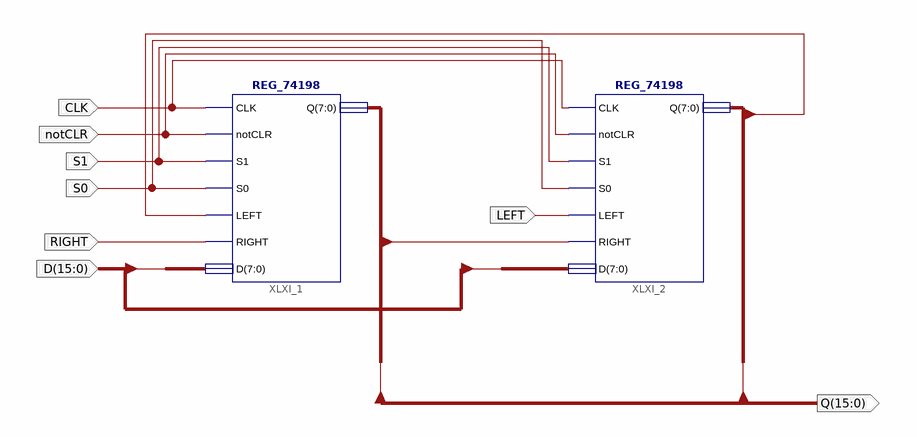
[diagram p0: schematic sheet 1]
// Xilinx ISE schematic REG_UNIT.sch (spartan3a) as structural Verilog: 2 symbols, 8 ports
module REG_UNIT (
  input  CLK,
  input  notCLR,
  input  S1,
  input  S0,
  input  [15:0] D,
  input  RIGHT,
  input  LEFT,
  output [15:0] Q
);

  REG_74198 XLXI_1 (.CLK(CLK), .notCLR(notCLR), .S1(S1), .S0(S0), .LEFT(Q[7]), .RIGHT(RIGHT), .D(D[15:8]), .Q(Q[15:8]));
  REG_74198 XLXI_2 (.CLK(CLK), .notCLR(notCLR), .S1(S1), .S0(S0), .LEFT(LEFT), .RIGHT(Q[8]), .D(D[7:0]), .Q(Q[7:0]));
endmodule
